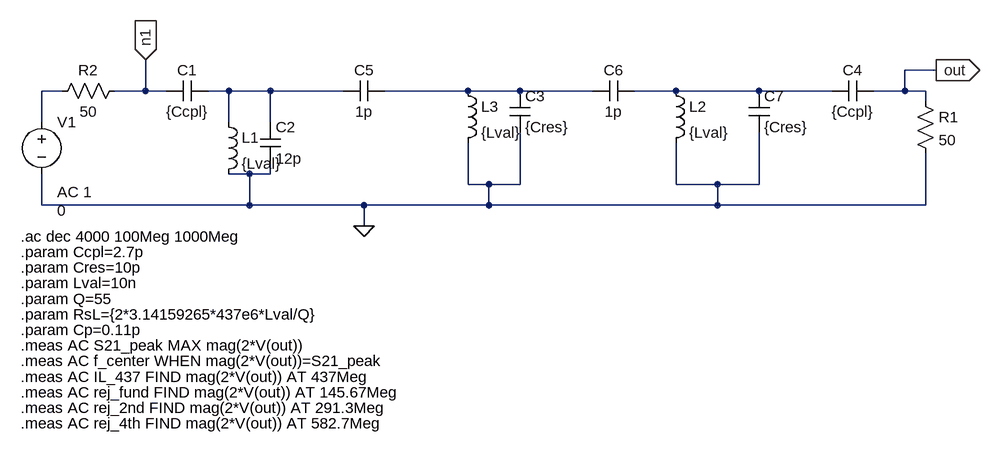
[diagram p0: schematic 437MHz_BPF_3rd_order_chebyshev.asc]
437MHz_BPF_3rd_order_chebyshev.asc, the LTspice schematic file:
Version 4.1
SHEET 1 2344 680
WIRE 1264 64 1216 64
WIRE -80 96 -112 96
WIRE 48 96 48 48
WIRE 48 96 0 96
WIRE 80 96 48 96
WIRE 176 96 144 96
WIRE 240 96 176 96
WIRE 352 96 240 96
WIRE 544 96 416 96
WIRE 624 96 544 96
WIRE 736 96 624 96
WIRE 864 96 800 96
WIRE 992 96 864 96
WIRE 1104 96 992 96
WIRE 1216 96 1216 64
WIRE 1216 96 1168 96
WIRE 1248 96 1216 96
WIRE 1248 112 1248 96
WIRE -112 144 -112 96
WIRE 176 144 176 96
WIRE 240 144 240 96
WIRE 208 224 176 224
WIRE 240 224 240 208
WIRE 240 224 208 224
WIRE 544 240 544 176
WIRE 576 240 544 240
WIRE 624 240 624 160
WIRE 624 240 576 240
WIRE 864 240 864 176
WIRE 928 240 864 240
WIRE 992 240 992 160
WIRE 992 240 928 240
WIRE -112 272 -112 224
WIRE 208 272 208 224
WIRE 208 272 -112 272
WIRE 384 272 208 272
WIRE 576 272 576 240
WIRE 576 272 384 272
WIRE 928 272 928 240
WIRE 928 272 576 272
WIRE 1248 272 1248 192
WIRE 1248 272 928 272
WIRE 384 304 384 272
FLAG 384 304 0
FLAG 48 48 n1
IOPIN 48 48 In
FLAG 1264 64 out
IOPIN 1264 64 Out
SYMBOL cap 144 80 R90
WINDOW 0 0 32 VBottom 2
WINDOW 3 32 32 VTop 2
SYMATTR InstName C1
SYMATTR Value {Ccpl}
SYMBOL cap 224 144 R0
SYMATTR InstName C2
SYMATTR Value 12p
SYMBOL cap 1168 80 R90
WINDOW 0 0 32 VBottom 2
WINDOW 3 32 32 VTop 2
SYMATTR InstName C4
SYMATTR Value {Ccpl}
SYMBOL ind 160 128 R0
SYMATTR InstName L1
SYMATTR Value {Lval}
SYMATTR SpiceLine Rser={RsL} Cpar={Cp}
SYMBOL voltage -112 128 R0
WINDOW 3 24 152 Left 2
WINDOW 123 24 124 Left 2
WINDOW 39 0 0 Left 0
SYMATTR Value 0
SYMATTR Value2 AC 1
SYMATTR InstName V1
SYMBOL res 1232 96 R0
SYMATTR InstName R1
SYMATTR Value 50
SYMBOL res 16 80 R90
WINDOW 0 0 56 VBottom 2
WINDOW 3 32 56 VTop 2
SYMATTR InstName R2
SYMATTR Value 50
SYMBOL ind 528 80 R0
SYMATTR InstName L3
SYMATTR Value {Lval}
SYMATTR SpiceLine Rser={RsL} Cpar={Cp}
SYMBOL cap 608 96 R0
SYMATTR InstName C3
SYMATTR Value {Cres}
SYMBOL cap 416 80 R90
WINDOW 0 0 32 VBottom 2
WINDOW 3 32 32 VTop 2
SYMATTR InstName C5
SYMATTR Value 1p
SYMBOL cap 800 80 R90
WINDOW 0 0 32 VBottom 2
WINDOW 3 32 32 VTop 2
SYMATTR InstName C6
SYMATTR Value 1p
SYMBOL ind 848 80 R0
SYMATTR InstName L2
SYMATTR Value {Lval}
SYMATTR SpiceLine Rser={RsL} Cpar={Cp}
SYMBOL cap 976 96 R0
SYMATTR InstName C7
SYMATTR Value {Cres}
TEXT -144 320 Left 2 !.ac dec 4000 100Meg 1000Meg
TEXT -144 392 Left 2 !.param Lval=10n
TEXT -144 368 Left 2 !.param Cres=10p
TEXT -144 344 Left 2 !.param Ccpl=2.7p
TEXT -144 416 Left 2 !.param Q=55
TEXT -144 440 Left 2 !.param RsL={2*3.14159265*437e6*Lval/Q}
TEXT -144 464 Left 2 !.param Cp=0.11p
TEXT -144 488 Left 2 !.meas AC S21_peak MAX mag(2*V(out))
TEXT -144 512 Left 2 !.meas AC f_center WHEN mag(2*V(out))=S21_peak
TEXT -144 536 Left 2 !.meas AC IL_437 FIND mag(2*V(out)) AT 437Meg
TEXT -144 560 Left 2 !.meas AC rej_fund FIND mag(2*V(out)) AT 145.67Meg
TEXT -144 584 Left 2 !.meas AC rej_2nd FIND mag(2*V(out)) AT 291.3Meg
TEXT -144 608 Left 2 !.meas AC rej_4th FIND mag(2*V(out)) AT 582.7Meg

The netlist it stands for:
* 437MHz_BPF_3rd_order_chebyshev.asc
C1 N002 n1 {Ccpl}
C2 N002 0 12p
C4 out N004 {Ccpl}
L1 N002 0 {Lval} Rser={RsL} Cpar={Cp}
V1 N001 0 0 AC 1
R1 out 0 50
R2 n1 N001 50
L3 N003 0 {Lval} Rser={RsL} Cpar={Cp}
C3 N003 0 {Cres}
C5 N003 N002 1p
C6 N004 N003 1p
L2 N004 0 {Lval} Rser={RsL} Cpar={Cp}
C7 N004 0 {Cres}
.ac dec 4000 100Meg 1000Meg
.param Lval=10n
.param Cres=10p
.param Ccpl=2.7p
.param Q=55
.param RsL={2*3.14159265*437e6*Lval/Q}
.param Cp=0.11p
.meas AC S21_peak MAX mag(2*V(out))
.meas AC f_center WHEN mag(2*V(out))=S21_peak
.meas AC IL_437 FIND mag(2*V(out)) AT 437Meg
.meas AC rej_fund FIND mag(2*V(out)) AT 145.67Meg
.meas AC rej_2nd FIND mag(2*V(out)) AT 291.3Meg
.meas AC rej_4th FIND mag(2*V(out)) AT 582.7Meg
.backanno
.end